# EAGLE design ABMS - VFG - SWITCHES 2 (EAGLE 5.10)
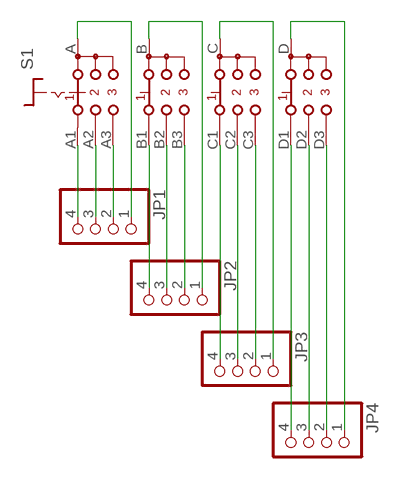
[diagram p0: schematic, sheet 1]

## Parts
JP1  PINHD-1X4  [1X04]
JP2  PINHD-1X4  [1X04]
JP3  PINHD-1X4  [1X04]
JP4  PINHD-1X4  [1X04]
S1  CK104X03  [CK104X03]

## Nets
N$1: JP1.4 S1.A1
N$2: JP1.3 S1.A2
N$3: JP1.2 S1.A3
N$4: JP1.1 S1.A
N$5: JP2.4 S1.B1
N$6: JP2.3 S1.B2
N$7: JP2.2 S1.B3
N$8: JP2.1 S1.B
N$9: JP3.4 S1.C1
N$10: JP3.3 S1.C2
N$11: JP3.2 S1.C3
N$12: JP3.1 S1.C
N$13: JP4.4 S1.D1
N$14: JP4.3 S1.D2
N$15: JP4.2 S1.D3
N$16: JP4.1 S1.D

## Library data of the parts
JP1-JP4 = pinhead:PINHD-1X4: PIN HEADER
S1 = switch:CK104X03: ROTARY SWITCH C&K

## Board
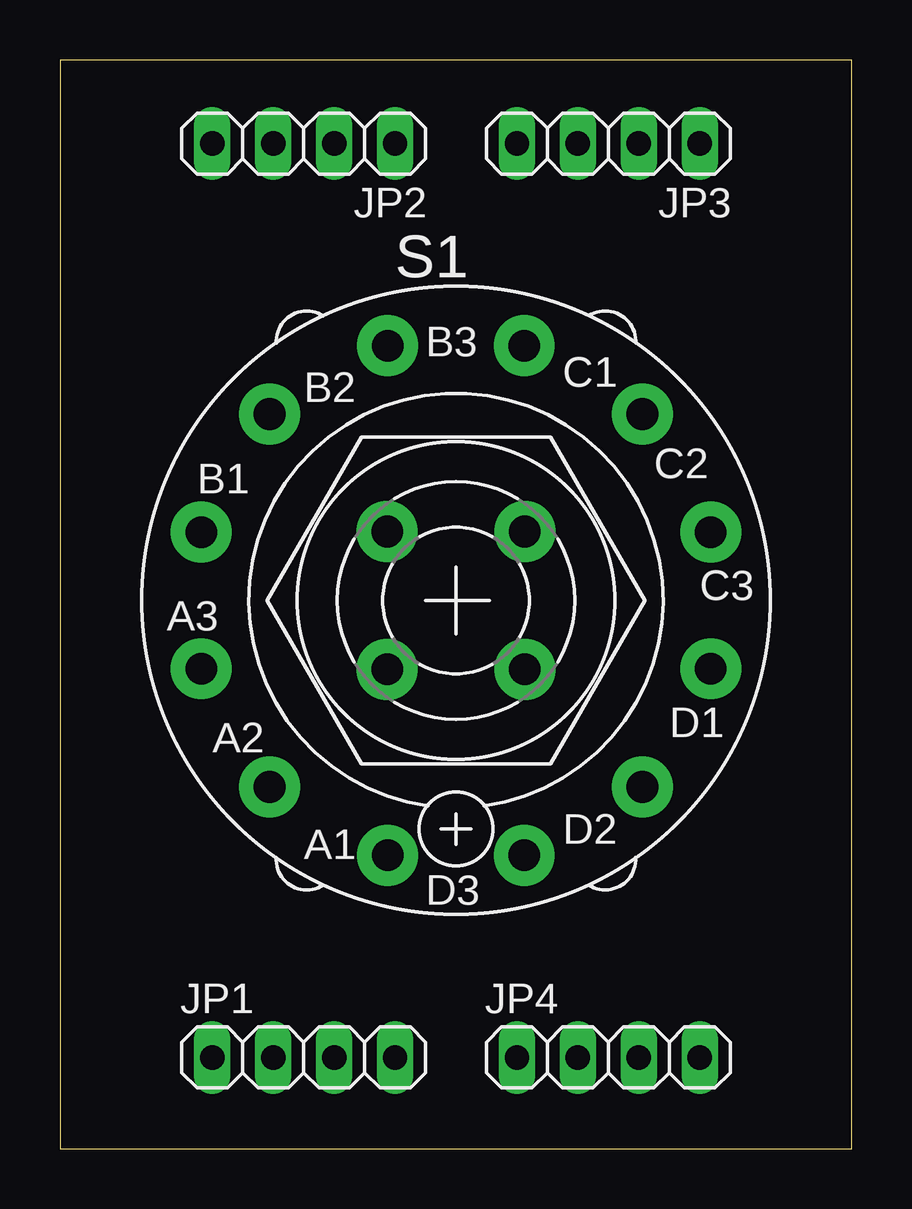
[diagram p1: board, top side]
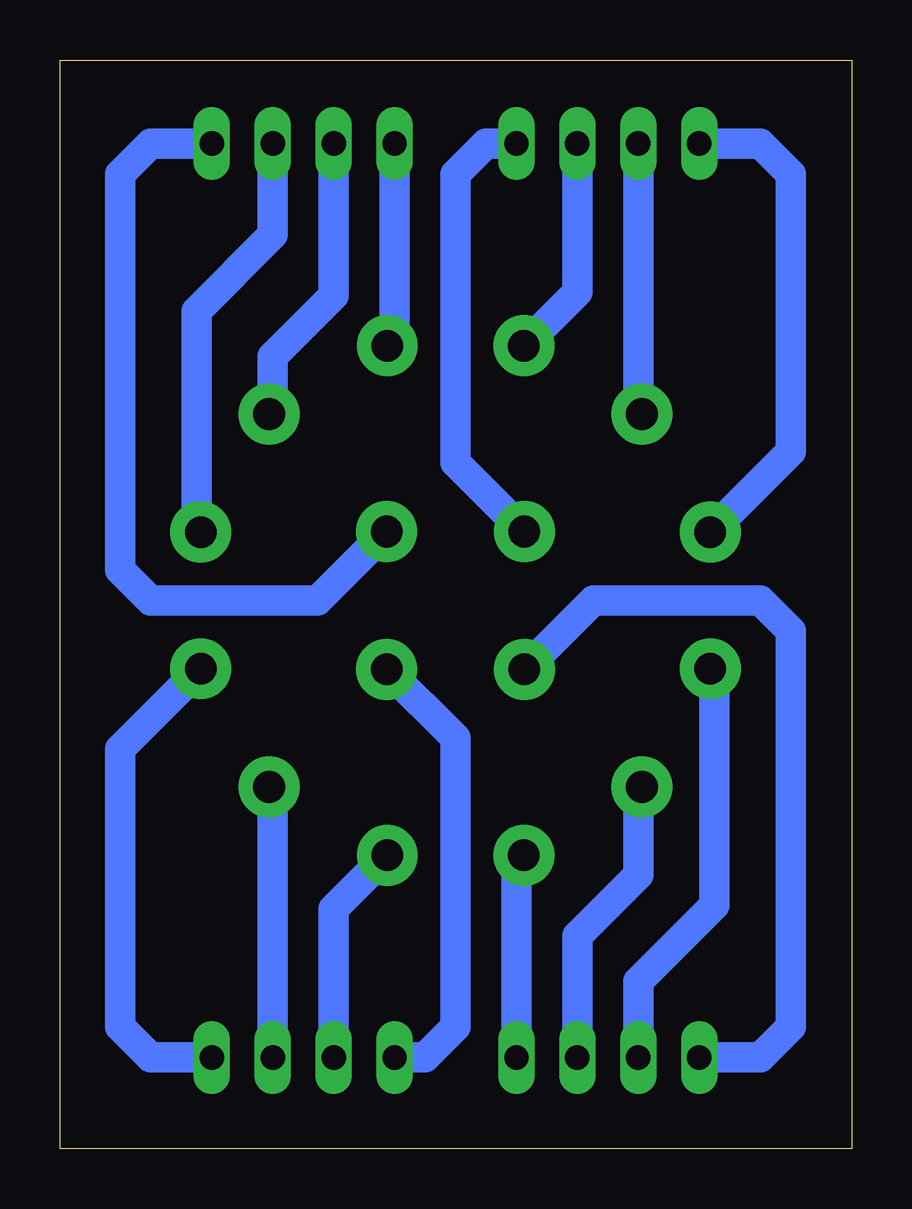
[diagram p2: board, bottom side, seen from below]

Size 33 x 45.39 mm. Coordinates in mm from the lower left corner, seen from the top.
Outline: 0,0 33,0 33,45.39 0,45.39 0,0
Copper layers (1*16): Top 0.035mm / dielectric 1.5mm / Bottom 0.035mm
Design rules "default": minimum track width 10mil, minimum drill 24mil, track to track 8mil, track to pad 8mil, pad to pad 8mil, via to via 8mil, smd to smd 8mil, copper to edge 40mil, drill to drill 8mil, minimum pad ring 10mil, minimum via ring 8mil, stop-mask expansion 4mil, vias tented up to drill 0mil, thermal gap 10mil

### Footprints (pad centres in the part's own frame; a part is rotated, then mirrored left to right if it is on the bottom)
1X04 = drill 1.016 long: 1 -3.81,0; 2 -1.27,0; 3 1.27,0; 4 3.81,0
CK104X03 = drill 1.321 pad 2.54 round: A -2.87,-2.87; A1 -2.845,-10.617; A2 -7.772,-7.772; A3 -10.617,-2.845; B -2.87,2.87; B1 -10.617,2.845; B2 -7.772,7.772; B3 -2.845,10.617; C 2.87,2.87; C1 2.845,10.617; C2 7.772,7.772; C3 10.617,2.845; D 2.87,-2.87; D1 10.617,-2.845; D2 7.772,-7.772; D3 2.845,-10.617

### Placement (x,y rotation side)
JP1  10.16,3.81 0 top
JP2  10.16,41.91 180 top
JP3  22.86,41.91 180 top
JP4  22.86,3.81 0 top
S1  16.51,22.86 0 top

### Tracks (layer width: path | path; a pad name or v marks a point on that pad's centre or on a via)
N$1
  Bottom 1.27: JP1.4 13.97,11.94 S1.A1
N$2
  Bottom 1.27: JP1.3 11.43,8.89 8.89,11.43 8.89,14.94 S1.A2
N$3
  Bottom 1.27: JP1.2 8.89,6.99 5.71,10.16 5.71,19.84 S1.A3
N$4
  Bottom 1.27: JP1.1 3.81,3.81 2.54,5.08 2.54,21.59 3.81,22.86 10.77,22.86 S1.A
N$5
  Bottom 1.27: JP2.4 3.81,41.91 2.54,40.64 2.54,29.06 S1.B1
N$6
  Bottom 1.27: JP2.3 8.89,30.79 S1.B2
N$7
  Bottom 1.27: JP2.2 11.43,35.71 S1.B3
N$8
  Bottom 1.27: JP2.1 15.24,41.91 16.51,40.64 16.51,28.6 S1.B
N$9
  Bottom 1.27: JP3.4 19.05,33.78 S1.C1
N$10
  Bottom 1.27: JP3.3 21.59,35.56 24.13,33.02 24.13,30.79 S1.C2
N$11
  Bottom 1.27: JP3.2 24.13,38.1 27.3,34.92 27.3,25.88 S1.C3
N$12
  Bottom 1.27: JP3.1 29.21,41.91 30.48,40.64 30.48,24.13 29.21,22.86 22.25,22.86 S1.C
N$13
  Bottom 1.27: JP4.4 29.21,3.81 30.48,5.08 30.48,16.66 S1.D1
N$14
  Bottom 1.27: JP4.3 24.13,14.94 S1.D2
N$15
  Bottom 1.27: JP4.2 21.59,10.01 S1.D3
N$16
  Bottom 1.27: JP4.1 17.78,3.81 16.51,5.08 16.51,17.12 S1.D